# Altium schematic sheet 04_ThermistorConnection.SchDoc
size Letter
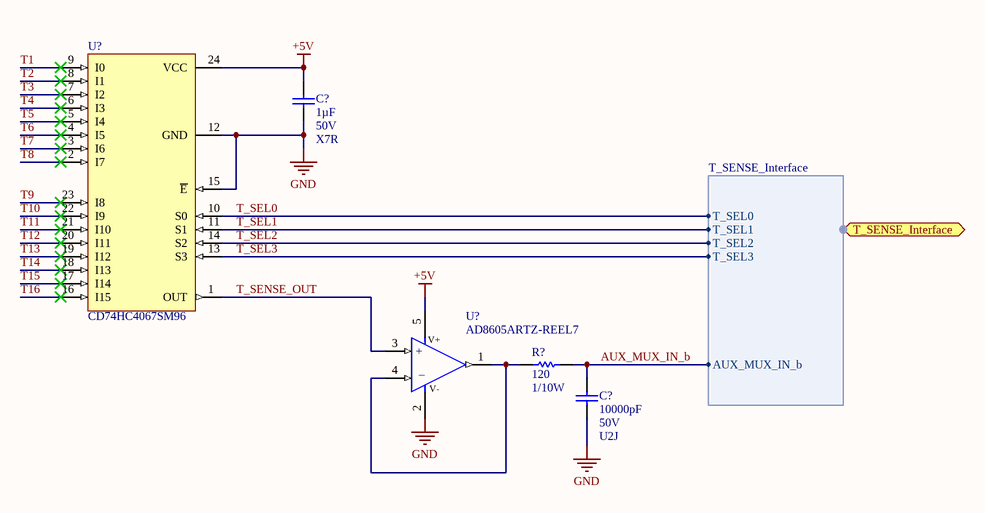
[diagram p0: 04_ThermistorConnection.SchDoc]

## Parts
(Parts that share a designator on the sheet are numbered #1, #2 ... from top to bottom, then left to right.)
C?#1  Capacitance: 1µF  Voltage: 50V  Temperature Coefficient: X7R  [CAP, 0603]  (hidden comment: CAP CER 1UF 50V 10% X7R 0603)
C?#2  Capacitance: 10000pF  Voltage: 50V  Temperature Coefficient: U2J  [CAP, 0603]  (hidden comment: CAP CER 10nF 50V 5% X7R 0603)
R?  Resistance: 120  Power: 1/10W  [RES, 0603]  (hidden comment: RES 120 OHM 1% 1/10W 0603)
U?#1  Manufacturer Part Number 1: CD74HC4067SM96  (hidden comment: IC MUX/DEMUX 1X16 24SSOP)
U?#2  Manufacturer Part Number 1: AD8605ARTZ-REEL7  (hidden comment: IC OPAMP RAIL-RAIL SOT23-5)

## Ports
T_SENSE_Interface (harness T_SENSE_Interface)

## Harnesses
T_SENSE_Interface: AUX_MUX_IN_b, T_SEL0, T_SEL1, T_SEL2, T_SEL3

## Nets
+5V: C?#1.1 U?#1.24(VCC) U?#2.5(V+)
GND: C?#1.2 C?#2.2 U?#1.12(GND) U?#1.15(~{E}) U?#2.2(V-)
AUX_MUX_IN_b: C?#2.1 R?.2 ; port T_SENSE_Interface.AUX_MUX_IN_b
T1: U?#1.9(I0)
T2: U?#1.8(I1)
T3: U?#1.7(I2)
T4: U?#1.6(I3)
T5: U?#1.5(I4)
T6: U?#1.4(I5)
T7: U?#1.3(I6)
T8: U?#1.2(I7)
T9: U?#1.23(I8)
T10: U?#1.22(I9)
T11: U?#1.21(I10)
T12: U?#1.20(I11)
T13: U?#1.19(I12)
T14: U?#1.18(I13)
T15: U?#1.17(I14)
T16: U?#1.16(I15)
T_SEL0: U?#1.10(S0) ; port T_SENSE_Interface.T_SEL0
T_SEL1: U?#1.11(S1) ; port T_SENSE_Interface.T_SEL1
T_SEL2: U?#1.14(S2) ; port T_SENSE_Interface.T_SEL2
T_SEL3: U?#1.13(S3) ; port T_SENSE_Interface.T_SEL3
T_SENSE_OUT: U?#1.1(OUT) U?#2.3(+IN)
NetR?_1: R?.1 U?#2.1(OUT) U?#2.4(-IN)

## Notes on the sheet
- (in symbol IC OPAMP RAIL-RAIL SOT23-5) +; _

## Library data of the parts
C?#1 = CAP CER 1UF 50V 10% X7R 0603: 1µF ±10% 50V Ceramic Capacitor X7R 0603 (1608 Metric); Manufacturer 1: Taiyo Yuden; Manufacturer Part Number 1: UMK107AB7105KA-T; Supplier 1: Digi-Key; Supplier Part Number 1: 587-3247-1-ND; Packaging: Cut Tape (CT); Part Status: Active; Operating Temperature: -55°C ~ 125°C; Ratings: -; Mounting Type: Surface Mount, MLCC; Package / Case: 0603 (1608 Metric); Size / Dimension: 0.063" L x 0.031" W (1.60mm x 0.80mm); Height - Seated (Max): -; Thickness (Max): 0.037" (0.95mm); Lead Spacing: -; Lead Style: -; ComponentLink1URL: http://www.yuden.co.jp/productdata/catalog/en/mlcc_all_e.pdf; ComponentLink1Description: http://www.yuden.co.jp/productdata/catalog/en/mlcc_all_e.pdf; Tolerance: ±10%
C?#2 = CAP CER 10nF 50V 5% X7R 0603: 10000pF ±5% 50V Ceramic Capacitor U2J 0603 (1608 Metric); Manufacturer 1: KEMET; Manufacturer Part Number 1: C0603C103J5JAC7867; Supplier 1: Digi-Key; Supplier Part Number 1: 399-13384-1-ND; Packaging: Cut Tape (CT); Part Status: Active; Operating Temperature: -55°C ~ 125°C; Ratings: -; Failure Rate: -; Mounting Type: Surface Mount, MLCC; Package / Case: 0603 (1608 Metric); Size / Dimension: 0.063" L x 0.032" W (1.60mm x 0.80mm); Height - Seated (Max): -; Thickness (Max): 0.034" (0.87mm); Lead Spacing: -; Lead Style: -; ComponentLink1URL: http://www.kemet.com/docfinder?Partnumber=C0603C103J5JAC7867; ComponentLink1Description: http://www.kemet.com/docfinder?Partnumber=C0603C103J5JAC7867; Tolerance: ±5%
R? = RES 120 OHM 1% 1/10W 0603: RES SMD 120 OHM 1% 1/10W 0603; Manufacturer 1: Yageo; Manufacturer Part Number 1: RC0603FR-07120RL; Temperature Coefficient: ±100ppm/°C; Supplier 1: Digi-Key; Supplier Part Number 1: 311-120HRCT-ND; Packaging: Cut Tape (CT); Part Status: Active; Composition: Thick Film; Operating Temperature: -55°C ~ 155°C; Package / Case: 0603 (1608 Metric); Supplier Device Package: 0603; Size / Dimension: 0.063" L x 0.031" W (1.60mm x 0.80mm); Height - Seated (Max): 0.022" (0.55mm); Failure Rate: -; ComponentLink1URL: http://www.yageo.com/documents/recent/PYu-RC_Group_51_RoHS_L_7.pdf; ComponentLink1Description: http://www.yageo.com/documents/recent/PYu-RC_Group_51_RoHS_L_7.pdf; Tolerance: ±1%
U?#1 = IC MUX/DEMUX 1X16 24SSOP: 1 Circuit IC Switch 16:1 160 Ohm 24-SSOP; Manufacturer 1: Texas Instruments; Number of Circuits: 1; On-State Resistance (Max): 160 Ohm; Channel-to-Channel Matching (&Delta;Ron): 8.5 Ohm; Voltage - Supply, Single (V+): 2 V ~ 6 V; Switch Time (Ton, Toff) (Max): 51ns, 49ns; -3db Bandwidth: 89MHz; Channel Capacitance (CS(off), CD(off)): 5pF, 50pF; Current - Leakage (IS(off)) (Max): 800nA; Supplier 1: Digi-Key; Supplier Part Number 1: 296-9226-1-ND; Packaging: Cut Tape (CT); Part Status: Active; Switch Circuit: -; Multiplexer/Demultiplexer Circuit: 16:1; Voltage - Supply, Dual (V±): -; Charge Injection: -; Crosstalk: -; Operating Temperature: -55°C ~ 125°C (TA); Package / Case: 24-SSOP (0.209", 5.30mm Width); Supplier Device Package: 24-SSOP; ComponentLink1URL: http://www.ti.com/lit/ds/symlink/cd74hc4067.pdf; ComponentLink1Description: http://www.ti.com/lit/ds/symlink/cd74hc4067.pdf
U?#2 = IC OPAMP RAIL-RAIL SOT23-5: General Purpose Amplifier 1 Circuit Rail-to-Rail SOT-23-5; Manufacturer 1: Analog Devices Inc.; Number of Circuits: 1; Slew Rate: 5 V/µs; Current - Supply: 1mA; Current - Output / Channel: 80mA; Voltage - Supply, Single/Dual (±): 2.7 V ~ 5.5 V; Supplier 1: Digi-Key; Supplier Part Number 1: AD8605ARTZREEL7CT-ND; Packaging: Cut Tape (CT); Part Status: Active; Amplifier Type: General Purpose; Output Type: Rail-to-Rail; -3db Bandwidth: -; Operating Temperature: -40°C ~ 125°C; Mounting Type: Surface Mount; Package / Case: SC-74A, SOT-753; Supplier Device Package: SOT-23-5; ComponentLink1URL: http://www.analog.com/media/en/technical-documentation/data-sheets/AD8605_8606_8608.pdf; ComponentLink1Description: http://www.analog.com/media/en/technical-documentation/data-sheets/AD8605_8606_8608.pdf